# EAGLE design untitled (EAGLE 7.5.0)
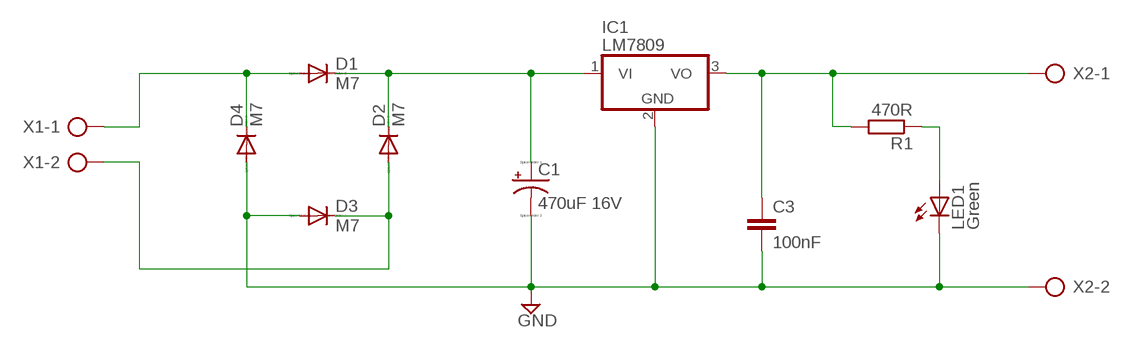
[diagram p0: schematic, sheet 1]

## Parts
C1  470uF 16V  CPOL-USE2.5-6  [E2,5-6]
C3  100nF  C-EUC0805  [C0805]
D1  M7  CGRM4003-G  [SOD-123_MINI-SMA]
D2  M7  CGRM4003-G  [SOD-123_MINI-SMA]
D3  M7  CGRM4003-G  [SOD-123_MINI-SMA]
D4  M7  CGRM4003-G  [SOD-123_MINI-SMA]
IC1  LM7809  7805T  [TO220H]
LED1  Green  LED5MM  [LED5MM]
R1  470R  R-EU_M3516  [M3516]
X1  AK500/2  [AK500/2]
X2  AK500/2  [AK500/2]

## Nets
GND: C1.- C3.2 D3.A D4.A IC1.2(GND) LED1.K(C) X2.2
N$1: C1.+ D1.C D2.C IC1.1(VI)
N$2: D2.A D3.C X1.2
N$4: D1.A D4.C X1.1
N$5: C3.1 IC1.3(VO) R1.2 X2.1
N$7: LED1.A R1.1

## Library data of the parts
C1 = resistor:CPOL-US: POLARIZED CAPACITOR, American symbol
C3 = resistor:C-EU: CAPACITOR, European symbol
D1-D4 = diode:CGRM400*-G: Molded plasitc,JEDEC SOD-123/Mini SMA Source: Comchip CGRM4001-G.pdf
IC1 = linear:78*: Positive VOLTAGE REGULATOR Source: http://cache.national.com/ds/LM/LM78L05.pdf http://www.fairchildsemi.com/ds/LM/LM7805.pdf
LED1 = led:LED: LED OSRAM: - CHIPLED LG R971, LG N971, LY N971, LG Q971, LY Q971, LO R971, LY R971 LH N974, LH R974 LS Q976, LO Q976, LY Q976 LO Q996 - Hyper CHIPLED LW Q18S LB Q993, LB Q99A, LB R99A - SideLED LS A670, LO A670, LY A670, LG A670, LP A670 LB A673, LV A673, LT A673, LW A673 LH A674 LY A675 LS A676, LA A676, LO A676, LY A676, LW A676 LS A679, LY A679, LG A679 - Hyper Micro SIDELED® LS Y876, LA Y876, LO Y876, LY Y876 LT Y87S - SmartLED LW L88C, LW L88S LB L89C, LB L89S, LG L890 LS L89K, LO L89K, LY L89K LS L896, LA L896, LO L896, LY L896 - TOPLED LS T670, LO T670, LY T670, LG T670, LP T670 LSG T670, LSP T670, LSY T670, LOP T670, LYG T670 LG T671, LOG T671, LSG T671 LB T673, LV T673, LT T673, LW T673 LH T674 LS T676, LA T676, LO T676, LY T676, LB T676, LH T676, LSB T676, LW T676 LB T67C, LV T67C, LT T67C, LS T67K, LO T67K, LY T67K, LW E67C LS E67B, LA E67B, LO E67B, LY E67B, LB E67C, LV E67C, LT E67C LW T67C LS T679, LY T679, LG T679 LS T770, LO T770, LY T770, LG T770, LP T770 LB T773, LV T773, LT T773, LW T773 LH T774 LS E675, LA E675, LY E675, LS T675 LS T776, LA T776, LO T776, LY T776, LB T776 LHGB T686 LT T68C, LB T68C - Hyper Mini TOPLED® LB M676 - Mini TOPLED Santana® LG M470 LS M47K, LO M47K, LY M47K Source: http://www.osram.convergy.de LUXEON: - LUMILED® LXK2-PW12-R00, LXK2-PW12-S00, LXK2-PW14-U00, LXK2-PW14-V00 LXK2-PM12-R00, LXK2-PM12-S00, LXK2-PM14-U00 LXK2-PE12-Q00, LXK2-PE12-R00, LXK2-PE12-S00, LXK2-PE14-T00, LXK2-PE14-U00 LXK2-PB12-K00, LXK2-PB12-L00, LXK2-PB12-M00, LXK2-PB14-N00, LXK2-PB14-P00, LXK2-PB14-Q00 LXK2-PR12-L00, LXK2-PR12-M00, LXK2-PR14-Q00, LXK2-PR14-R00 LXK2-PD12-Q00, LXK2-PD12-R00, LXK2-PD12-S00 LXK2-PH12-R00, LXK2-PH12-S00 LXK2-PL12-P00, LXK2-PL12-Q00, LXK2-PL12-R00 Source: www.luxeon.com KINGBRIGHT: KA-3528ASYC Source: www.kingbright.com
R1 = rcl:R-EU_: RESISTOR, European symbol
X1 X2 = con-ptr500:AK500/2: CONNECTOR; OC_FARNELL: unknown; OC_NEWARK: unknown

## Board
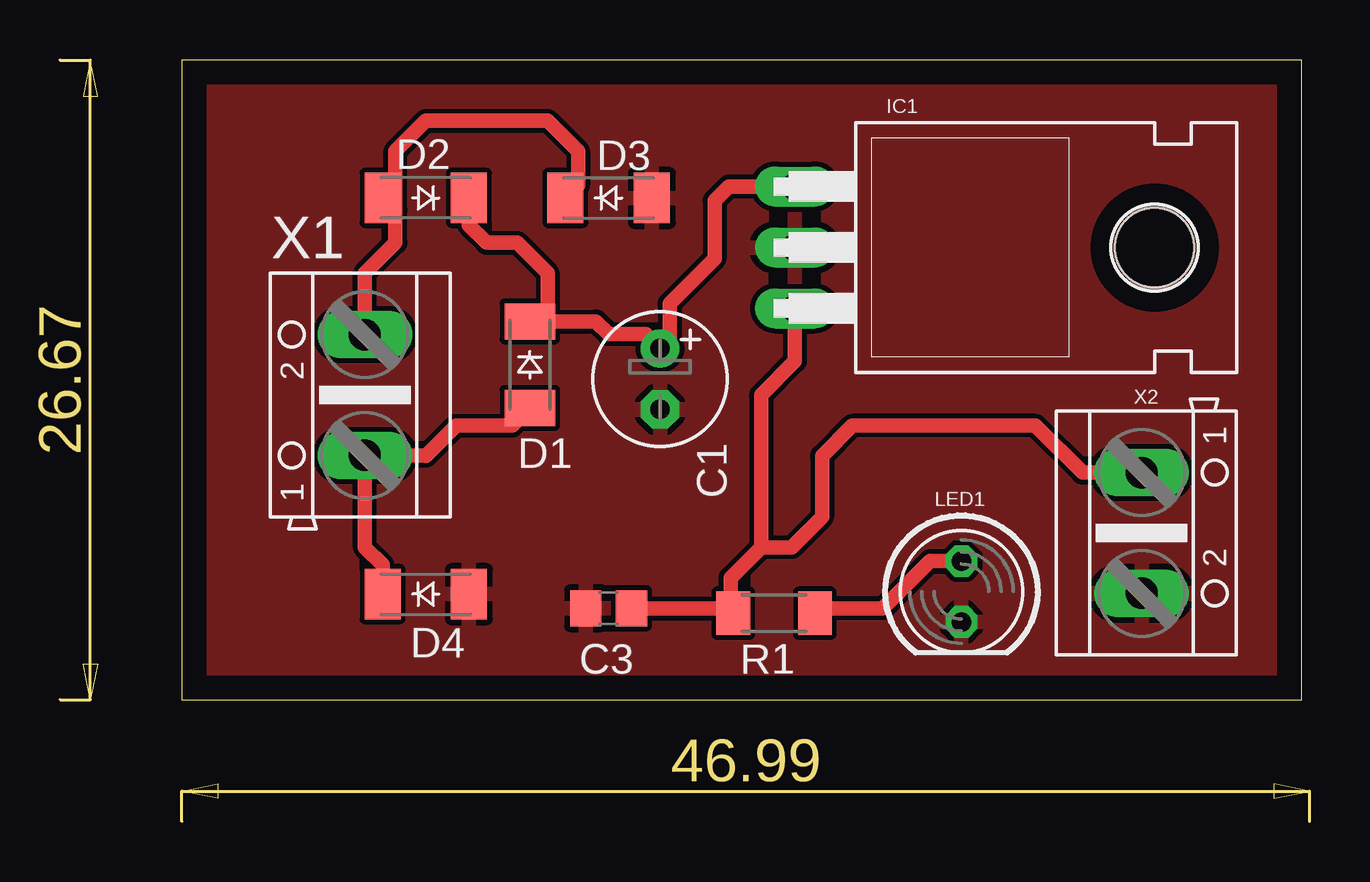
[diagram p1: board, top side]

Size 46.66 x 26.66 mm. Coordinates in mm from the lower left corner, seen from the top.
Outline: 0,0 46.66,0 46.66,26.66 0,26.66 0,0
Copper layers (1*16): Top 0.035mm / dielectric 1.5mm / Bottom 0.035mm
Design rules "default": minimum track width 10mil, minimum drill 24mil, track to track 8mil, track to pad 8mil, pad to pad 8mil, via to via 8mil, smd to smd 8mil, copper to edge 40mil, drill to drill 8mil, minimum pad ring 10mil, minimum via ring 8mil, stop-mask expansion 4mil, vias tented up to drill 0mil, thermal gap 10mil

### Footprints (pad centres in the part's own frame; a part is rotated, then mirrored left to right if it is on the bottom)
E2,5-6 = drill 0.813 pad 1.6: + -1.27,0 | drill 0.813 pad 1.6 octagon: - 1.27,0
C0805 = smd 1.3 x 1.5: 1 -0.95,0; 2 0.95,0
SOD-123_MINI-SMA = smd 1.5 x 2.1: A 1.8,0; C -1.8,0
TO220H = drill 1.118 long: 1 -2.54,-10.16; 2 0,-10.16; 3 2.54,-10.16 | hole 3.302: 0,4.826
LED5MM = drill 0.813 octagon: A -1.27,0; K 1.27,0
M3516 = smd 1.4 x 1.8: 1 -1.7,0; 2 1.7,0
AK500/2 = drill 1.321 long: 1 -2.515,0; 2 2.515,0

### Placement (x,y rotation side)
C1  19.92,13.37 270 top
C3  17.78,3.81 180 top
D1  14.5,13.97 270 top
D2  10.16,20.92 180 top
D3  17.78,20.92 0 top
D4  10.16,4.4 0 top
IC1  35.7,18.85 270 top
LED1  32.48,4.51 270 top
R1  24.67,3.61 180 top
X1  7.62,12.7 90 top
X2  39.99,6.95 270 top

### Tracks (layer width: path | path; a pad name or v marks a point on that pad's centre or on a via)
GND
  pour Top: 0,0 0,26.67 46.99,26.67 46.99,0
N$1
  Top 0.6: D1.C 15.24,15.77 | 15.24,15.77 17.25,15.77 17.78,15.24 19.32,15.24 C1.+ 20.32,15.04 20.32,16.51 22.2,18.39 22.2,20.8 22.79,21.39 IC1.1 | D2.C 11.96,19.79 12.7,19.05 13.97,19.05 15.24,17.78 15.24,15.77
N$2
  Top 0.6: X1.2 7.62,17.78 8.89,19.05 8.89,20.39 | 8.89,20.39 D2.A | 8.89,20.39 8.89,22.86 10.16,24.13 15.24,24.13 16.51,22.86 16.51,21.45 D3.C
N$4
  Top 0.6: D1.A 13.76,11.43 11.43,11.43 10.16,10.16 10.13,10.19 X1.1 7.62,6.35 8.36,5.61 D4.C
N$5
  Top 0.6: IC1.3 25.54,14.11 24.13,12.7 24.13,6.35 | C3.1 22.77,3.81 R1.2 22.86,3.72 22.86,5.08 24.13,6.35 | X2.1 37.52,9.46 35.56,11.43 27.94,11.43 26.67,10.16 26.67,7.62 25.4,6.35 24.13,6.35
N$7
  Top 0.6: LED1.A 31.18,5.78 29.21,3.81 26.57,3.81 R1.1